# Altium schematic sheet Endstop.SchDoc
size A4; SheetNumber: 2; SheetTotal: 8
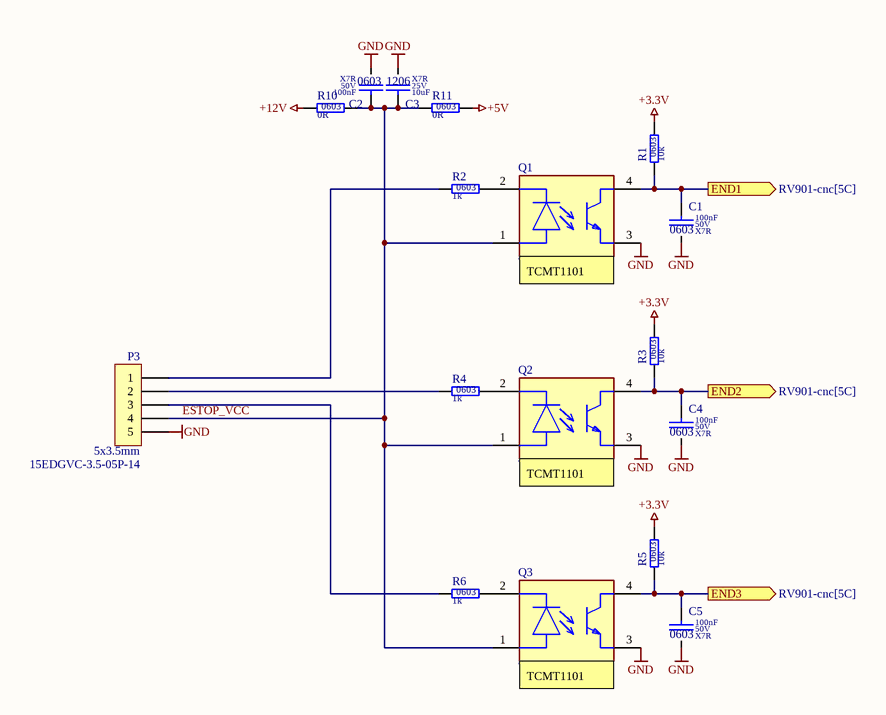
[diagram p0: Endstop.SchDoc]

## Parts
C1  value 100nF  Dielectric: X7R  Voltage: 50V  SCH_Footprint: 0603  [C_0603_1608]  (hidden comment: Ceramic X7R)
C2  value 100nF  Dielectric: X7R  Voltage: 50V  SCH_Footprint: 0603  [C_0603_1608]  (hidden comment: Ceramic X7R)
C3  value 10uF  Dielectric: X7R  Voltage: 25V  SCH_Footprint: 1206  [C_1206_3216]  (hidden comment: Ceramic X7R)
C4  value 100nF  Dielectric: X7R  Voltage: 50V  SCH_Footprint: 0603  [C_0603_1608]  (hidden comment: Ceramic X7R)
C5  value 100nF  Dielectric: X7R  Voltage: 50V  SCH_Footprint: 0603  [C_0603_1608]  (hidden comment: Ceramic X7R)
P3  value 15EDGVC-3.5-05P-14  SCH_Footprint: 5x3.5mm  [P_15EDGVC-3.5-05P]  (hidden comment: 5-pin 3.5mm terminal block)
Q1  TCMT1106  [FP-TCMT1106-MFG]
Q2  TCMT1106  [FP-TCMT1106-MFG]
Q3  TCMT1106  [FP-TCMT1106-MFG]
R1  value 10k  SCH_Footprint: 0603  [R_0603_1608]  (hidden comment: Resistor)
R2  value 1k  SCH_Footprint: 0603  [R_0603_1608]  (hidden comment: Resistor)
R3  value 10k  SCH_Footprint: 0603  [R_0603_1608]  (hidden comment: Resistor)
R4  value 1k  SCH_Footprint: 0603  [R_0603_1608]  (hidden comment: Resistor)
R5  value 10k  SCH_Footprint: 0603  [R_0603_1608]  (hidden comment: Resistor)
R6  value 1k  SCH_Footprint: 0603  [R_0603_1608]  (hidden comment: Resistor)
R10  value 0R  SCH_Footprint: 0603  [R_0603_1608]  (hidden comment: Resistor)
R11  value 0R  SCH_Footprint: 0603  [R_0603_1608]  (hidden comment: Resistor)

## Ports
END1 (out, see RV901-cnc[5C]), END2 (out, see RV901-cnc[5C]), END3 (out, see RV901-cnc[5C])

## Nets
+3.3V: R1.2 R3.2 R5.2
+5V: R11.2
+12V: R10.1
GND: C1.2 C2.2 C3.2 C4.2 C5.2 P3.5 Q1.3(E) Q2.3(E) Q3.3(E)
END1: C1.1 Q1.4(C) R1.1 ; port END1
END2: C4.1 Q2.4(C) R3.1 ; port END2
END3: C5.1 Q3.4(C) R5.1 ; port END3
ESTOP_VCC: C2.1 C3.1 P3.4 Q1.1(A) Q2.1(A) Q3.1(A) R10.2 R11.1
NetP3_1: P3.1 R2.1
NetP3_2: P3.2 R4.1
NetP3_3: P3.3 R6.1
NetQ1_2: Q1.2(C) R2.2
NetQ2_2: Q2.2(C) R4.2
NetQ3_2: Q3.2(C) R6.2

## Notes on the sheet
- (near Q1) TCMT1101
- (near Q2) TCMT1101
- (near Q3) TCMT1101

## Library data of the parts
C1 C2 C4 C5 = C_100nF_50V_X7R_0603_5: Capacitor; Manufacturer: Samsung; Manufacturer Part Number: CL10B104JB8NNNC; Tolerance (%): 5; Part Number: C_100nF_50V_X7R_0603_5; HelpURL: http://www.tme.eu/pl/Document/4a42202b32dab16128fe107dd69598cc/samsung-chip-cap.pdf; Supplier 1: TME; Supplier Part Number 1: CL10B104JB8NNNC; Supplier 2: RS Components; Supplier Part Number 2: 7665455; Supplier 3: Farnell; Supplier 4: Mouser; Supplier 5: Digi-Key; Supplier Part Number 5: 1276-1033-1-ND; Supplier 6: LCSC; Supplier Part Number 6: C24452
C3 = C_10uF_25V_X7R_1206_10: Capacitor; Manufacturer: Samsung; Manufacturer Part Number: CL31B106KAHNNNE; Tolerance (%): 10; Part Number: C_10uF_25V_X7R_1206_10; HelpURL: http://www.tme.eu/pl/Document/4a42202b32dab16128fe107dd69598cc/samsung-chip-cap.pdf; Supplier 1: TME; Supplier Part Number 1: CL31B106KAHNNNE; Supplier 2: RS Components; Supplier Part Number 2: 766-6773; Supplier 3: Farnell; Supplier Part Number 3: 3013526; Supplier 4: Mouser; Supplier Part Number 4: 187-CL31B106KAHNNNE; Supplier 5: Digi-Key; Supplier Part Number 5: 1276-1804-1-ND; Supplier 6: LCSC
P3 = P_15EDGVC-3.5-05P-14: Pin Header; Manufacturer: DEGSON ELECTRONICS; Part Number: P_15EDGVC-3.5-05P-14; HelpURL: https://www.tme.eu/Document/83e7173fe653a2d0e44585e87978945b/opr014R8.pdf; Manufacturer Part Number: 15EDGVC-3.5-05P-14; Supplier 1: TME; Supplier 2: RS Components; Supplier 3: Farnell; Supplier 4: Mouser; Supplier 5: Digi-Key; Supplier 6: LCSC; Supplier Part Number 6: C7603430; Supplier 7: Conrad; Supplier Part Number 7: 1327356
Q1-Q3 = CMP-00030-39642376-1: TCMT1106 TCMT1106 Vishay Transistor Output Optocouplers Phototransistor Out 3750Vrms1 Channel 4-SOP RoHS; Current Transfer Ratio: 300%; Reverse Voltage: 6V; Number of Channels: 1; Turn-Off Delay Time: 8.5µs; Power Dissipation: 250mW; Output Current per Channel: 50mA; Voltage Rating (DC): 70V; Forward Current: 60mA; Turn-On Delay Time: 9.5µs; Rise Time: 3s; Isolation Voltage: 3.75kV; Fall Time: 4.7s; Max Junction Temperature (Tj): 125°C; Collector Emitter Saturation Voltage: 300mV; Forward Voltage: 1.35V; Ambient Temperature Range High: 100°C; Height: 2.3mm; Mount: PCB, Surface Mount; Max Operating Temperature: 100°C; Radiation Hardening: No; RoHS: Compliant; Min Operating Temperature: -40°C; NexarPartId: 39642376; Number of Pins: 4; Output Voltage: 70V; Max Output Voltage: 70V; Reverse Breakdown Voltage: 6V; Voltage: 6V; Collector Emitter Voltage (VCEO): 70V; Number of Elements: 1; Max Collector Current: 50mA; Schedule B: 8541408000, 8541408000; Input Current: 50mA; Max Power Dissipation: 250mW; Packaging: Tape and Reel; Max Input Current: 60mA; Case/Package: SOP; Lead Free: Lead Free; REACH SVHC: Unknown
R1 R3 R5 = R_10k_0603_1_AECQ0: Manufacturer: Panasonic; Manufacturer Part Number: ERJ-3EKF1002V; Voltage: 75V; Power: 100mW; Tolerance: 1%; AEC-Q: 0; Part Number: R_10k_0603_1_AECQ0; HelpURL: https://industrial.panasonic.com/cdbs/www-data/pdf/RDA0000/AOA0000C304.pdf; Supplier 1: TME; Supplier Part Number 1: ERJ3EKF1002V; Supplier 2: RS Components; Supplier 3: Farnell; Supplier Part Number 3: 2303192; Supplier 4: Mouser; Supplier Part Number 4: 667-ERJ-3EKF1002V; Supplier 5: Digi-Key; Supplier Part Number 5: P10.0KHCT-ND; Supplier 6: LCSC; Supplier Part Number 6: C191124
R2 R4 R6 = R_1k_0603_1_AECQ0: Manufacturer: Panasonic; Manufacturer Part Number: ERJ-3EKF1001V; Voltage: 75V; Power: 100mW; Tolerance: 1%; AEC-Q: 0; Part Number: R_1k_0603_1_AECQ0; HelpURL: https://industrial.panasonic.com/cdbs/www-data/pdf/RDA0000/AOA0000C304.pdf; Supplier 1: TME; Supplier Part Number 1: ERJ3EKF1001V; Supplier 2: RS Components; Supplier 3: Farnell; Supplier Part Number 3: 2303145; Supplier 4: Mouser; Supplier Part Number 4: 667-ERJ-3EKF1001V; Supplier 5: Digi-Key; Supplier Part Number 5: P1.00KHCT-ND; Supplier 6: LCSC
R10 R11 = R_0R_0603_1: Manufacturer: Yageo; Manufacturer Part Number: RC0603FR-070RL; Voltage: 75V; Power: 100mW; Tolerance: 1%; Part Number: R_0R_0603_1; HelpURL: https://datasheet.octopart.com/RC0603FR-070RL-Yageo-datasheet-8328172.pdf; Supplier 1: TME; Supplier Part Number 1: RC0603FR-070RL; Supplier 2: RS Components; Supplier 3: Farnell; Supplier Part Number 3: 2309106; Supplier 4: Mouser; Supplier Part Number 4: 603-RC0603FR-070RL; Supplier 5: Digi-Key; Supplier Part Number 5: 311-0.0HRCT-ND; Supplier 6: LCSC; Supplier Part Number 6: C100044